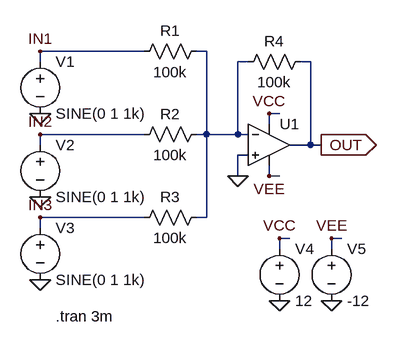
[diagram p0: schematic Adder.asc]
Adder.asc, the LTspice schematic file:
Version 4
SHEET 1 880 680
WIRE 16 80 -144 80
WIRE 112 80 96 80
WIRE -144 96 -144 80
WIRE 176 96 160 96
WIRE 272 96 256 96
WIRE 224 176 208 176
WIRE 208 192 208 176
WIRE 16 208 -144 208
WIRE 112 208 112 80
WIRE 112 208 96 208
WIRE 160 208 160 96
WIRE 160 208 112 208
WIRE 176 208 160 208
WIRE -144 224 -144 208
WIRE 272 224 272 96
WIRE 272 224 240 224
WIRE 288 224 272 224
WIRE 176 240 160 240
WIRE 160 272 160 240
WIRE 208 272 208 256
WIRE 224 272 208 272
WIRE 16 336 -144 336
WIRE 112 336 112 208
WIRE 112 336 96 336
WIRE -144 352 -144 336
WIRE 240 368 224 368
WIRE 320 368 304 368
WIRE 224 384 224 368
WIRE 304 384 304 368
FLAG 208 176 VCC
FLAG 208 272 VEE
FLAG -144 176 0
FLAG -144 304 0
FLAG -144 432 0
FLAG 160 272 0
FLAG 288 224 OUT
IOPIN 288 224 Out
FLAG 224 464 0
FLAG 304 464 0
FLAG 224 368 VCC
FLAG 304 368 VEE
FLAG -144 80 IN1
FLAG -144 208 IN2
FLAG -144 336 IN3
SYMBOL OpAmps\\UniversalOpAmp2 208 224 R0
SYMATTR InstName U1
SYMBOL res 112 64 R90
WINDOW 0 0 56 VBottom 2
WINDOW 3 32 56 VTop 2
SYMATTR InstName R1
SYMATTR Value 100k
SYMBOL res 112 192 R90
WINDOW 0 0 56 VBottom 2
WINDOW 3 32 56 VTop 2
SYMATTR InstName R2
SYMATTR Value 100k
SYMBOL res 112 320 R90
WINDOW 0 0 56 VBottom 2
WINDOW 3 32 56 VTop 2
SYMATTR InstName R3
SYMATTR Value 100k
SYMBOL res 272 80 R90
WINDOW 0 0 56 VBottom 2
WINDOW 3 32 56 VTop 2
SYMATTR InstName R4
SYMATTR Value 100k
SYMBOL voltage -144 80 R0
WINDOW 123 0 0 Left 0
WINDOW 39 0 0 Left 0
SYMATTR InstName V1
SYMATTR Value SINE(0 1 1k)
SYMBOL voltage -144 208 R0
WINDOW 123 0 0 Left 0
WINDOW 39 0 0 Left 0
SYMATTR InstName V2
SYMATTR Value SINE(0 1 1k)
SYMBOL voltage -144 336 R0
WINDOW 123 0 0 Left 0
WINDOW 39 0 0 Left 0
SYMATTR InstName V3
SYMATTR Value SINE(0 1 1k)
SYMBOL voltage 224 368 R0
WINDOW 123 0 0 Left 0
WINDOW 39 0 0 Left 0
SYMATTR InstName V4
SYMATTR Value 12
SYMBOL voltage 304 368 R0
WINDOW 123 0 0 Left 0
WINDOW 39 0 0 Left 0
SYMATTR InstName V5
SYMATTR Value -12
TEXT -120 488 Left 2 !.tran 3m

The netlist it stands for:
* Adder.asc
XU1 0 N001 VCC VEE OUT level2 Avol=1Meg GBW=10Meg Slew=10Meg Ilimit=25m Rail=0 Vos=0 En=0 Enk=0 In=0 Ink=0 Rin=500Meg  ; pins In+ In- V+ V- OUT
R1 N001 IN1 100k
R2 N001 IN2 100k
R3 N001 IN3 100k
R4 OUT N001 100k
V1 IN1 0 SINE(0 1 1k)
V2 IN2 0 SINE(0 1 1k)
V3 IN3 0 SINE(0 1 1k)
V4 VCC 0 12
V5 VEE 0 -12
.tran 3m
.lib UniversalOpAmp2.lib
.backanno
.end